# EAGLE design MainSchem (EAGLE 9.5.2)
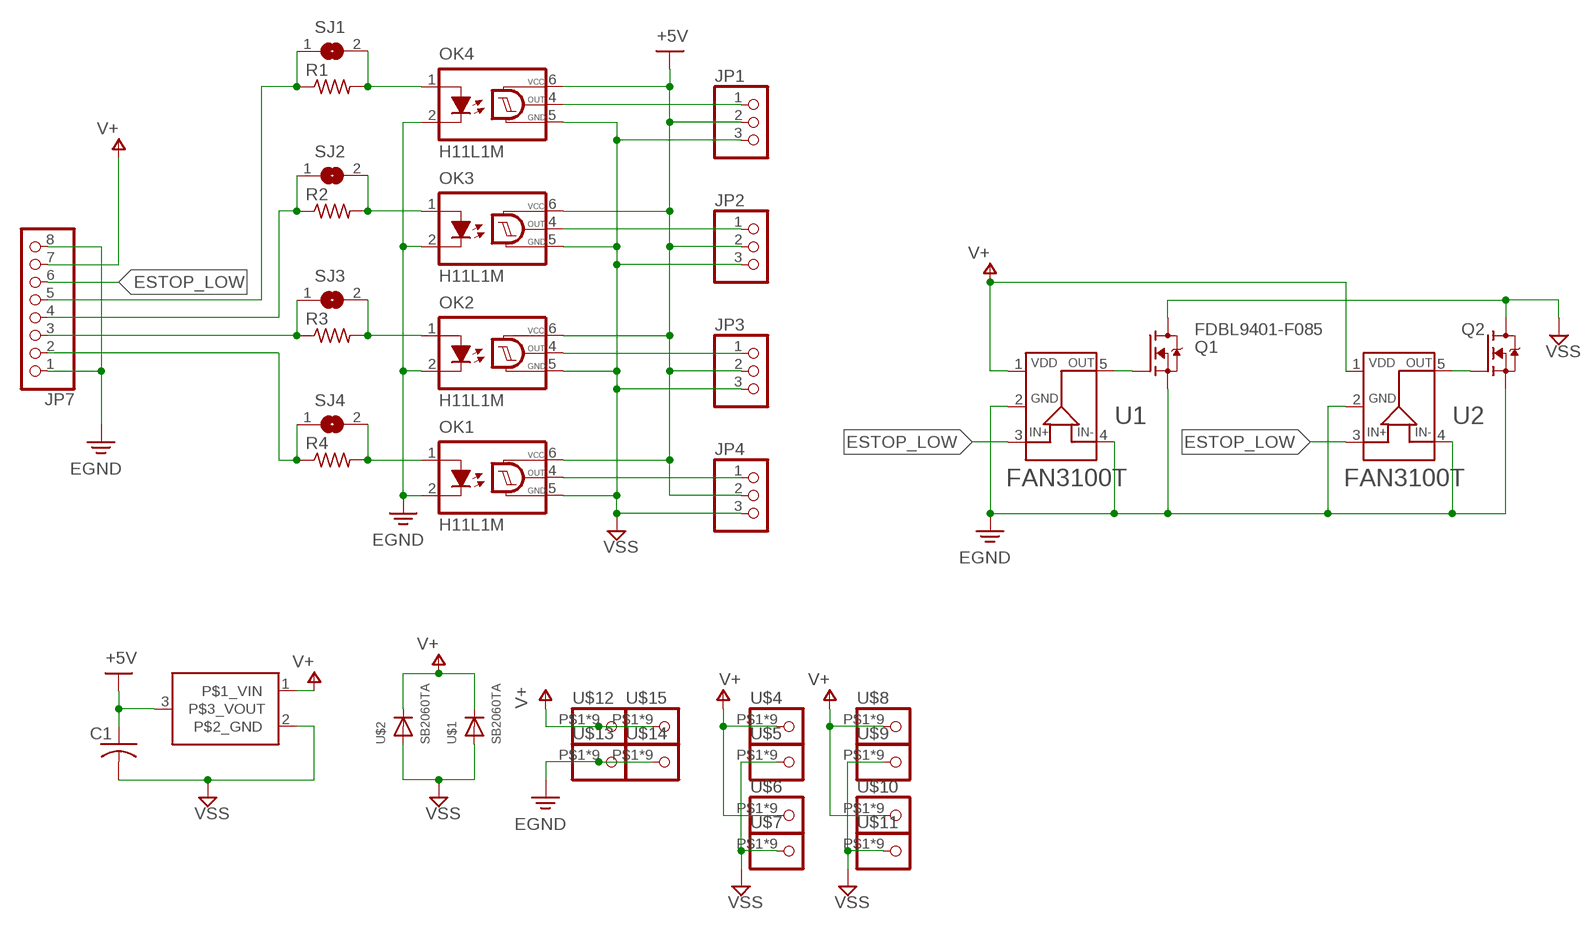
[diagram p0: schematic, sheet 1]

## Parts
C1  C-US025-025X050  [C025-025X050]
JP1  PINHD-1X3  [1X03]
JP2  PINHD-1X3  [1X03]
JP3  PINHD-1X3  [1X03]
JP4  PINHD-1X3  [1X03]
JP7  PINHD-1X8  [1X08]
OK1  H11L1M  [DIL06]
OK2  H11L1M  [DIL06]
OK3  H11L1M  [DIL06]
OK4  H11L1M  [DIL06]
Q1  FDBL9401-F085  FDBL86361-F085  [MOSFET_FDBL86361-F085]
Q2  FDBL9401-F085  FDBL86361-F085  [MOSFET_FDBL86361-F085]
R1  R-US_0204/7  [0204/7]
R2  R-US_0204/7  [0204/7]
R3  R-US_0204/7  [0204/7]
R4  R-US_0204/7  [0204/7]
SJ1  SJ  [SJ]
SJ2  SJ  [SJ]
SJ3  SJ  [SJ]
SJ4  SJ  [SJ]
U1  FAN3100T  [SOT23-5]
U2  FAN3100T  [SOT23-5]
U$1  SB2060TA  GENERIC_DIODE_DO201AD  [C4111-15]
U$2  SB2060TA  GENERIC_DIODE_DO201AD  [C4111-15]
U$3  REGULATOR_5V  [TO220]
U$4  HIGH_CURRENT_WIRE_PAD  [HIGH_CURRENT_WIRE_PAD]
U$5  HIGH_CURRENT_WIRE_PAD  [HIGH_CURRENT_WIRE_PAD]
U$6  HIGH_CURRENT_WIRE_PAD  [HIGH_CURRENT_WIRE_PAD]
U$7  HIGH_CURRENT_WIRE_PAD  [HIGH_CURRENT_WIRE_PAD]
U$8  HIGH_CURRENT_WIRE_PAD  [HIGH_CURRENT_WIRE_PAD]
U$9  HIGH_CURRENT_WIRE_PAD  [HIGH_CURRENT_WIRE_PAD]
U$10  HIGH_CURRENT_WIRE_PAD  [HIGH_CURRENT_WIRE_PAD]
U$11  HIGH_CURRENT_WIRE_PAD  [HIGH_CURRENT_WIRE_PAD]
U$12  HIGH_CURRENT_WIRE_PAD  [HIGH_CURRENT_WIRE_PAD]
U$13  HIGH_CURRENT_WIRE_PAD  [HIGH_CURRENT_WIRE_PAD]
U$14  HIGH_CURRENT_WIRE_PAD  [HIGH_CURRENT_WIRE_PAD]
U$15  HIGH_CURRENT_WIRE_PAD  [HIGH_CURRENT_WIRE_PAD]

## Nets
+5V: C1.1 JP1.2 JP2.2 JP3.2 JP4.2 OK1.6(VCC) OK2.6(VCC) OK3.6(VCC) OK4.6(VCC) U$3.3(P$3_VOUT)
EGND: JP7.1 JP7.8 OK1.2(C) OK2.2(C) OK3.2(C) OK4.2(C) Q1.2(S) Q1.3(S) Q1.4(S) Q1.5(S) Q1.6(S) Q1.7(S) Q1.8(S) Q2.2(S) Q2.3(S) Q2.4(S) Q2.5(S) Q2.6(S) Q2.7(S) Q2.8(S) U1.2(GND) U1.4(IN-) U2.2(GND) U2.4(IN-) U$13.P$1 U$13.P$2 U$13.P$3 U$13.P$4 U$13.P$5 U$13.P$6 U$13.P$7 U$13.P$8 U$13.P$9 U$14.P$1 U$14.P$2 U$14.P$3 U$14.P$4 U$14.P$5 U$14.P$6 U$14.P$7 U$14.P$8 U$14.P$9
ESTOP_LOW: JP7.6 U1.3(IN+) U2.3(IN+)
N$4: Q2.1(G) U2.5(OUT)
N$5: OK1.1(A) R4.2 SJ4.2
N$6: Q1.1(G) U1.5(OUT)
N$9: JP4.1 OK1.4(OUT)
N$10: JP7.2 R4.1 SJ4.1
N$11: JP3.1 OK2.4(OUT)
N$12: JP2.1 OK3.4(OUT)
N$13: JP1.1 OK4.4(OUT)
N$15: JP7.3 R3.1 SJ3.1
N$16: OK2.1(A) R3.2 SJ3.2
N$17: OK3.1(A) R2.2 SJ2.2
N$18: JP7.4 R2.1 SJ2.1
N$19: OK4.1(A) R1.2 SJ1.2
N$20: JP7.5 R1.1 SJ1.1
V+: JP7.7 U1.1(VDD) U2.1(VDD) U$1.C U$2.C U$3.1(P$1_VIN) U$4.P$1 U$4.P$2 U$4.P$3 U$4.P$4 U$4.P$5 U$4.P$6 U$4.P$7 U$4.P$8 U$4.P$9 U$6.P$1 U$6.P$2 U$6.P$3 U$6.P$4 U$6.P$5 U$6.P$6 U$6.P$7 U$6.P$8 U$6.P$9 U$8.P$1 U$8.P$2 U$8.P$3 U$8.P$4 U$8.P$5 U$8.P$6 U$8.P$7 U$8.P$8 U$8.P$9 U$10.P$1 U$10.P$2 U$10.P$3 U$10.P$4 U$10.P$5 U$10.P$6 U$10.P$7 U$10.P$8 U$10.P$9 U$12.P$1 U$12.P$2 U$12.P$3 U$12.P$4 U$12.P$5 U$12.P$6 U$12.P$7 U$12.P$8 U$12.P$9 U$15.P$1 U$15.P$2 U$15.P$3 U$15.P$4 U$15.P$5 U$15.P$6 U$15.P$7 U$15.P$8 U$15.P$9
VSS: C1.2 JP1.3 JP2.3 JP3.3 JP4.3 OK1.5(GND) OK2.5(GND) OK3.5(GND) OK4.5(GND) Q1.9_1(D) Q1.9_2(D) Q1.9_3(D) Q1.9_4(D) Q2.9_1(D) Q2.9_2(D) Q2.9_3(D) Q2.9_4(D) U$1.A U$2.A U$3.2(P$2_GND) U$5.P$1 U$5.P$2 U$5.P$3 U$5.P$4 U$5.P$5 U$5.P$6 U$5.P$7 U$5.P$8 U$5.P$9 U$7.P$1 U$7.P$2 U$7.P$3 U$7.P$4 U$7.P$5 U$7.P$6 U$7.P$7 U$7.P$8 U$7.P$9 U$9.P$1 U$9.P$2 U$9.P$3 U$9.P$4 U$9.P$5 U$9.P$6 U$9.P$7 U$9.P$8 U$9.P$9 U$11.P$1 U$11.P$2 U$11.P$3 U$11.P$4 U$11.P$5 U$11.P$6 U$11.P$7 U$11.P$8 U$11.P$9

## Library data of the parts
C1 = adafruit:C-US: CAPACITOR, American symbol
JP1-JP4 = adafruit:PINHD-1X3: PIN HEADER
JP7 = pinhead:PINHD-1X8: PIN HEADER
OK1-OK4 = optocoupler:H11L*M: 6-Pin DIP Optocoupler Source: http://www.fairchildsemi.com/ds/H1/H11L2-M.pdf; MF: FAIRCHILD SEMICONDUCTOR; MPN: H11L1-M; OC_FARNELL: 1021127; OC_NEWARK: 72K8643
Q1 Q2 = FDBL86361-F085:FDBL86361-F085: MOSFET N-CH 80V 300A PSOF8; DESCRIPTION: N-Channel 80V 300A _Tc_ 429W _Tj_ Surface Mount 8-HPSOF; DIGI-KEY_PART_NUMBER: FDBL86361-F085CT-ND; DIGI-KEY_PURCHASE_URL: https://www.digikey.com/product-detail/en/on-semiconductor/FDBL86361-F085/FDBL86361-F085CT-ND/5209202?utm_source=snapeda&utm_medium=aggregator&utm_campaign=symbol; MF: ON Semiconductor; MP: FDBL86361-F085; PACKAGE: PowerSFN-8 ON Semiconductor
R1-R4 = adafruit:R-US_: RESISTOR, American symbol
SJ1-SJ4 = jumper:SJ: SMD solder JUMPER
U1 U2 = HighCurrentTransistorAndDriver:FAN3100T: FAN3100T
U$1 U$2 = HighCurrentTransistorAndDriver:GENERIC_DIODE_DO201AD
U$3 = HighCurrentTransistorAndDriver:REGULATOR_5V
U$4-U$15 = HighCurrentTransistorAndDriver:HIGH_CURRENT_WIRE_PAD

## Board
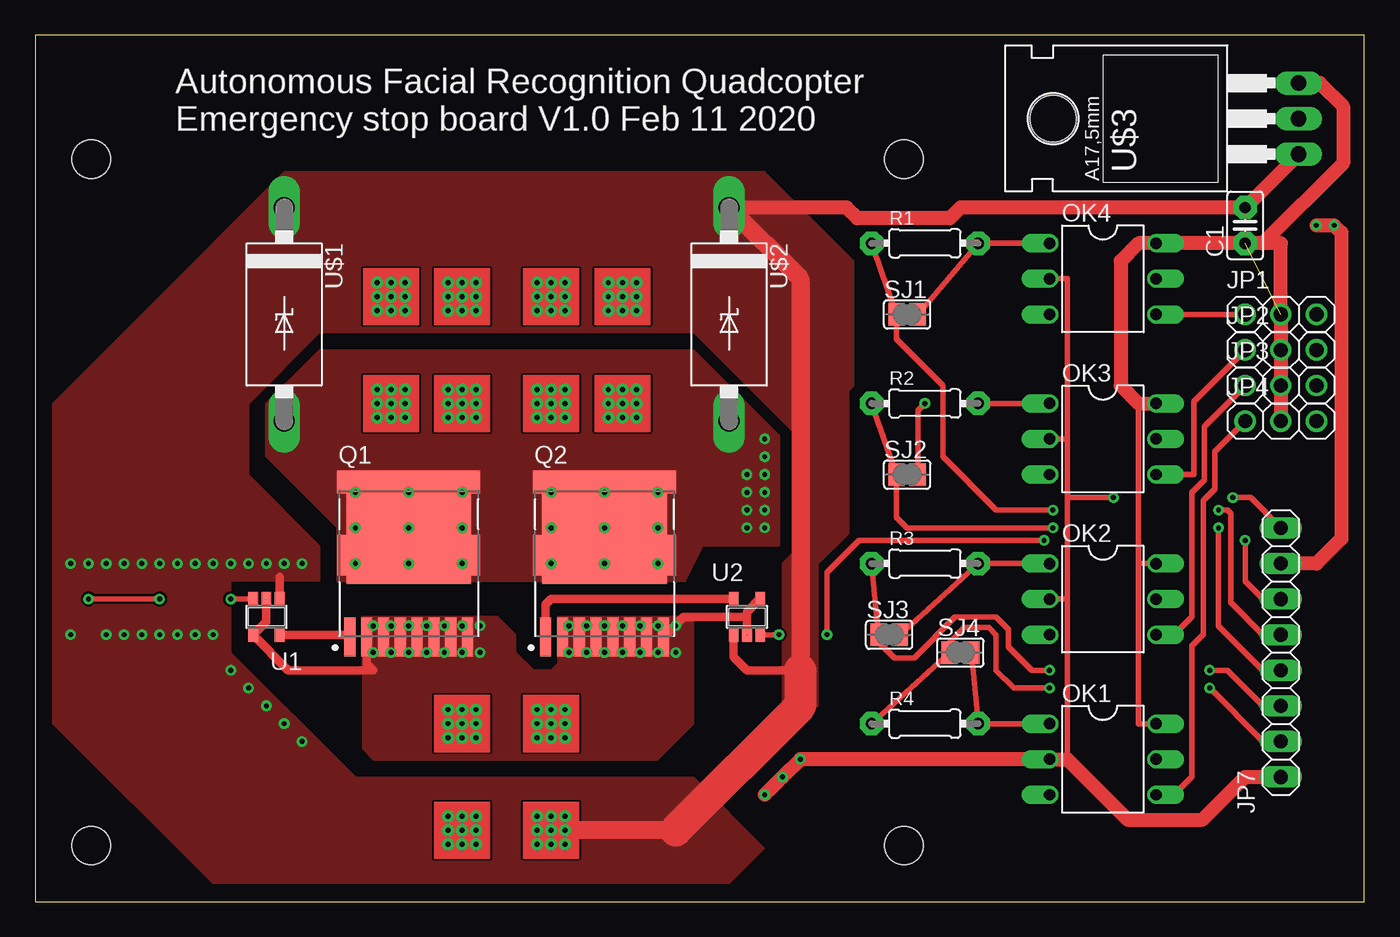
[diagram p1: board, top side]
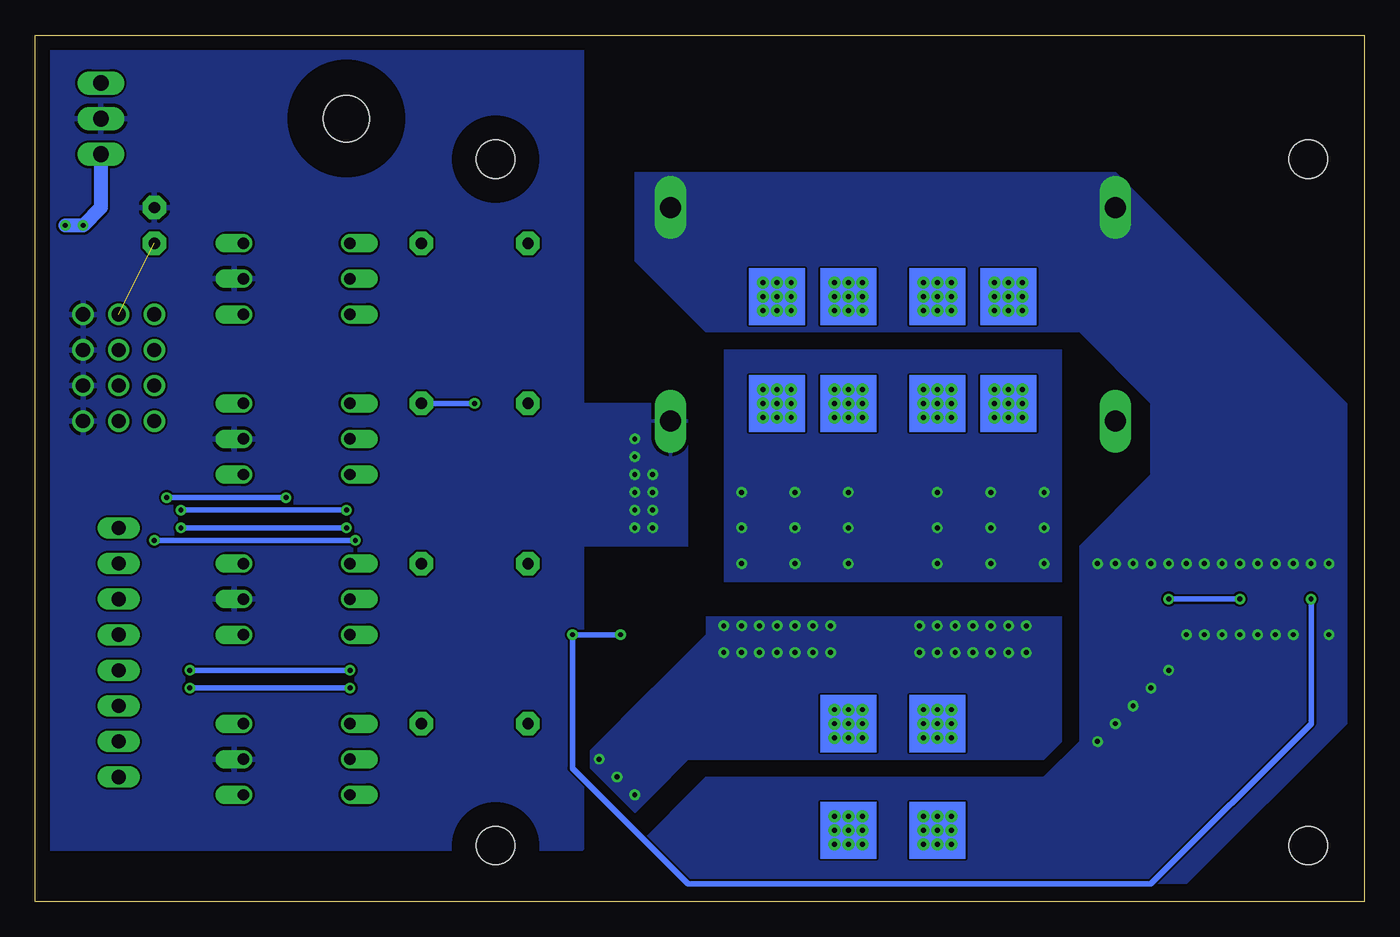
[diagram p2: board, bottom side, seen from below]

Size 94.87 x 61.85 mm. Coordinates in mm from the lower left corner, seen from the top.
Outline: 0,0 94.87,0 94.87,61.85 0,61.85 0,0
Copper layers (1*16): Top 0.035mm / dielectric 1.5mm / Bottom 0.035mm
Design rules "default": minimum track width 6mil, minimum drill 0.35mm, track to track 6mil, track to pad 6mil, pad to pad 6mil, via to via 6mil, smd to smd 6mil, copper to edge 40mil, drill to drill 6mil, minimum pad ring 10mil, minimum via ring 8mil, stop-mask expansion 4mil, vias tented up to drill 0mil, thermal gap 10mil

### Footprints (pad centres in the part's own frame; a part is rotated, then mirrored left to right if it is on the bottom)
C025-025X050 = drill 0.813 pad 1.676 octagon: 1 -1.27,0; 2 1.27,0
1X03 = drill 1.016: 1 -2.54,0; 2 0,0; 3 2.54,0
1X08 = drill 1.016 long: 1 -8.89,0; 2 -6.35,0; 3 -3.81,0; 4 -1.27,0; 5 1.27,0; 6 3.81,0; 7 6.35,0; 8 8.89,0
DIL06 = drill 0.813 offset: 1 -2.54,-3.81; 2 0,-3.81; 3 2.54,-3.81; 4 2.54,3.81; 5 0,3.81; 6 -2.54,3.81
MOSFET_FDBL86361-F085 = smd 0.8 x 2.8: 1 -4.2,-5.24; 2 -3,-5.24; 3 -1.8,-5.24; 4 -0.6,-5.24; 5 0.6,-5.24; 6 1.8,-5.24; 7 3,-5.24; 8 4.2,-5.24 | smd 10.2 x 1.65: 9_1 0,5.815 | smd 8.9 x 2.95: 9_2 0,3.515 | smd 10.2 x 2.9: 9_3 0,0.59 | smd 8.9 x 0.6: 9_4 0,-1.16
0204/7 = drill 0.813 pad 1.676 octagon: 1 -3.81,0; 2 3.81,0
SJ = smd 1.168 x 1.6: 1 -0.762,0; 2 0.762,0
SOT23-5 = smd 0.69 x 0.99: 1 -0.95,-1.29; 2 0,-1.29; 3 0.95,-1.29; 4 0.95,1.3; 5 -0.95,1.3
C4111-15 = drill 1.499 long: A 7.62,0; C -7.62,0
TO220 = drill 1.118 long: 1 -2.54,-6.35; 2 0,-6.35; 3 2.54,-6.35 | hole 3.302: 0,11.176
HIGH_CURRENT_WIRE_PAD = drill 0.35: P$1 -1,1; P$2 0,1; P$3 1,1; P$4 -1,0; P$5 0,0; P$6 1,0; P$7 -1,-1; P$8 0,-1; P$9 1,-1
RPI_MOUNTING_HOLE = hole 2.75: 0,0

### Placement (x,y rotation side)
C1  86.36,48.26 90 top
JP1  88.9,41.91 0 top
JP2  88.9,39.37 0 top
JP3  88.9,36.83 0 top
JP4  88.9,34.29 0 top
JP7  88.9,17.78 90 top
OK1  76.2,10.16 270 top
OK2  76.2,21.59 270 top
OK3  76.2,33.02 270 top
OK4  76.2,44.45 270 top
Q1  26.67,24.13 0 top
Q2  40.64,24.13 0 top
R1  63.5,46.99 0 top
R2  63.5,35.56 0 top
R3  63.5,24.13 0 top
R4  63.5,12.7 0 top
SJ1  62.23,41.91 0 top
SJ2  62.23,30.48 0 top
SJ3  60.96,19.05 0 top
SJ4  66.04,17.78 0 top
U1  16.51,20.32 180 top
U2  50.8,20.32 0 top
U$1  17.78,41.91 270 top
U$2  49.53,41.91 270 top
U$3  83.82,55.88 90 top
U$4  41.91,43.18 0 top
U$5  36.83,35.56 0 top
U$6  30.48,43.18 0 top
U$7  25.4,35.56 270 bottom
U$8  25.4,43.18 270 bottom
U$9  30.48,35.56 270 bottom
U$10  36.83,43.18 270 bottom
U$11  41.91,35.56 270 bottom
U$12  30.48,5.08 270 bottom
U$13  30.48,12.7 270 bottom
U$14  36.83,12.7 0 top
U$15  36.83,5.08 0 top
U$16  [RPI_MOUNTING_HOLE]  4,4 0 top
U$17  [RPI_MOUNTING_HOLE]  4,53 0 top
U$18  [RPI_MOUNTING_HOLE]  62,53 0 top
U$19  [RPI_MOUNTING_HOLE]  62,4 0 top

### Tracks (layer width: path | path; a pad name or v marks a point on that pad's centre or on a via)
+5V  (1 unrouted)
  Top 0.406: OK2.6 78.74,24.13 | 78.74,24.13 78.74,35.56 | 78.74,24.13 78.74,12.7 OK1.6
  Top 1.016: 87.63,46.99 88.9,46.99 JP1.2 JP2.2 JP3.2 JP4.2 | 87.63,46.99 OK4.6 78.74,46.99 77.47,45.72 77.47,36.83 78.74,35.56 OK3.6 | 87.63,46.99 93.34,52.7 93.34,56.77 91.69,58.42 U$3.3
EGND  (via drill 0.35)
  Top 0.406: 73.66,33.02 73.66,44.45 OK4.2 | 73.66,33.02 73.66,28.83 | 73.66,28.83 73.66,21.59 | 73.66,21.59 73.66,10.16 | OK2.2 73.66,21.59 | OK3.2 73.66,33.02 | JP7.8 86.74,28.83 v85.47,28.83 | v76.96,28.83 73.66,28.83
  Top 0.61: U1.2 16.51,19.97 U1.4 18.07,16.51 24.13,16.51 23.67,16.97 Q1.2 | U2.2 50.8,20.32 | 50.8,20.32 50.8,20.67 U2.4 | Q2.8 46.27,20.32 50.8,20.32
  Top 1.016: JP7.1 86.36,8.89 83.31,5.84 77.98,5.84 73.66,10.16 OK1.2 v54.61,10.16 v53.34,8.89 v52.07,7.62
  Bottom 0.406: v85.47,28.83 v76.96,28.83
  other vias: 24.13,19.68 25.4,19.68 26.67,19.68 27.94,19.68 29.21,19.68 30.48,19.68 31.75,19.68 24.13,17.78 25.4,17.78 26.67,17.78 27.94,17.78 29.21,17.78 30.48,17.78 31.75,17.78 38.1,17.78 39.37,17.78 40.64,17.78 41.91,17.78 43.18,17.78 44.45,17.78 45.72,17.78 38.1,19.68 39.37,19.68 40.64,19.68 41.91,19.68 43.18,19.68 44.45,19.68 45.72,19.68
  pour Top (no thermals): 46.99,20.32 37.34,20.32 37.34,17.02 36.83,16.51 35.56,16.51 34.29,17.78 34.29,19.05 33.02,20.32 23.37,20.32 23.37,10.92 24.13,10.16 44.45,10.16 46.99,12.7
  pour Bottom: 46.99,11.43 52.07,6.35 55.24,9.53 55.24,10.79 50.8,15.24
  pour Bottom (no thermals): 21.59,11.43 21.59,20.32 46.99,20.32 46.99,19.05 52.07,13.97 48.26,10.16 22.86,10.16
ESTOP_LOW  (via drill 0.35)
  Top 0.406: JP7.6 87.63,21.59 86.36,22.86 v86.36,25.78 | U2.3 53.07,19.03 v53.09,19.05 | v56.52,19.05 56.52,23.5 58.8,25.78 v72.01,25.78 | U1.3 15.54,21.59 v13.97,21.59 | v8.89,21.59 v3.81,21.59
  Bottom 0.406: v86.36,25.78 v72.01,25.78 | v53.09,19.05 v56.52,19.05 56.52,9.53 48.26,1.27 15.24,1.27 3.81,12.7 v3.81,21.59 | v13.97,21.59 v8.89,21.59
N$4
  Top 0.61: Q2.1 36.44,21.2 36.83,21.59 49.82,21.59 U2.5
N$5
  Top 0.406: OK1.1 R4.2 SJ4.2
N$6
  Top 0.61: U1.5 22.34,19.02 Q1.1
N$9
  Top 0.406: JP4.1 84.2,32.13 84.2,29.46 83.36,28.63 83.36,19.07 82.55,18.26 82.55,8.89 81.28,7.62 OK1.4
N$10  (via drill 0.35)
  Top 0.406: v83.82,15.24 87.63,11.43 JP7.2 | R4.1 SJ4.1 65.28,18.54 66.29,19.56 68.07,19.56 68.58,19.05 68.58,16.51 69.85,15.24 v72.39,15.24
  Bottom 0.406: v72.39,15.24 v83.82,15.24
N$11
  Top 0.406: JP3.1 83.44,33.91 83.44,30.1 82.55,29.21 82.55,20.32 81.28,19.05 OK2.4
N$12
  Top 0.406: OK3.4 82.68,30.48 82.68,35.69 JP2.1
N$13
  Top 0.406: OK4.4 JP1.1
N$15  (via drill 0.35)
  Top 0.406: v83.82,16.51 85.09,16.51 87.63,13.97 JP7.3 | R3.1 SJ3.1 60.2,18.54 61.34,17.4 62.74,17.4 65.66,20.32 68.58,20.32 69.47,19.43 69.47,18.16 71.12,16.51 v72.39,16.51
  Bottom 0.406: v72.39,16.51 v83.82,16.51
N$16
  Top 0.406: OK2.1 R3.2 SJ3.2
N$17  (via drill 0.35)
  Top 0.406: OK3.1 R2.2 | SJ2.2 62.99,35.05 v63.5,35.56
  Bottom 0.406: v63.5,35.56 R2.2
N$18  (via drill 0.35)
  Top 0.406: R2.1 SJ2.1 61.47,27.43 62.23,26.67 v72.64,26.67 | JP7.4 87.63,16.51 84.45,19.68 v84.45,26.67
  Bottom 0.406: v72.64,26.67 v84.45,26.67
N$19
  Top 0.406: OK4.1 R1.2 SJ1.2
N$20  (via drill 0.35)
  Top 0.406: R1.1 SJ1.1 61.47,40.13 64.77,36.83 64.77,31.75 68.58,27.94 v72.64,27.94 | v84.45,27.94 85.09,27.94 85.34,27.69 85.34,21.34 87.63,19.05 JP7.5
  Bottom 0.406: v72.64,27.94 v84.45,27.94
V+  (via drill 0.35)
  Top 0.61: U1.1 17.46,23.18 | U2.1 49.85,17.46 50.8,16.51 54.61,16.51
  Top 1.016: JP7.7 91.44,24.13 93.22,25.91 93.22,47.75 v92.71,48.26 v91.44,48.26 | U$3.1 86.36,49.53 66.04,49.53 65.28,48.77 58.67,48.77 57.91,49.53 U$2.C
  Top 1.27: U$2.C 54.61,44.45 54.61,16.51 | 45.72,5.08 U$15.P$5
  Top 2.286: 54.61,16.51 54.61,13.97 45.72,5.08
  Bottom 1.016: U$3.1 90.17,49.53 v91.44,48.26 v92.71,48.26
  other vias: 5.08,19.05 6.35,19.05 7.62,19.05 8.89,19.05 10.16,19.05 11.43,19.05 12.7,19.05 13.97,16.51 15.24,15.24 16.51,13.97 17.78,12.7 19.05,11.43 2.54,19.05 2.54,24.13 3.81,24.13 5.08,24.13 6.35,24.13 7.62,24.13 8.89,24.13 10.16,24.13 11.43,24.13 12.7,24.13 13.97,24.13 15.24,24.13 16.51,24.13 17.78,24.13 19.05,24.13
  pour Top (no thermals): 15.24,35.56 20.32,40.64 46.99,40.64 54.61,33.02 54.61,25.4 53.34,24.13 53.34,13.97 55.88,13.97 55.88,24.13 58.04,26.29 58.04,36.45 58.42,36.83 58.42,45.72 52.07,52.07 17.78,52.07 12.7,46.99 12.7,35.56
  pour Top: 46.99,8.89 52.07,3.81 49.53,1.27 12.7,1.27 1.27,12.7 1.27,35.56 13.97,48.26 13.97,36.83 15.24,35.56 15.24,30.48 20.32,25.4 20.32,22.86 13.97,22.86 13.97,17.78 22.86,8.89
  pour Bottom (no thermals): 46.99,40.64 52.07,45.72 52.07,52.07 17.78,52.07 1.27,35.56 1.27,12.7 12.7,1.27 49.53,1.27 52.07,3.81 46.99,8.89 22.86,8.89 20.32,11.43 20.32,25.4 15.24,30.48 15.24,35.56 20.32,40.64
VSS  (via drill 0.35)
  other vias: 50.8,26.67 52.07,26.67 50.8,27.94 52.07,27.94 50.8,29.21 52.07,29.21 50.8,30.48 52.07,30.48 52.07,31.75 52.07,33.02 22.86,29.21 22.86,26.67 22.86,24.13 26.67,24.13 26.67,26.67 26.67,29.21 30.48,26.67 30.48,24.13 30.48,29.21 36.83,24.13 36.83,26.67 36.83,29.21 40.64,29.21 40.64,24.13 40.64,26.67 44.45,26.67 44.45,24.13 44.45,29.21
  pour Bottom: 55.88,60.96 55.88,3.81 93.98,3.81 93.98,60.96
  pour Top (no thermals): 20.32,39.37 46.99,39.37 53.09,33.27 53.09,25.4 47.62,25.4 46.35,22.86 21.59,22.86 21.59,26.67 16.51,31.75 16.51,35.56
  pour Bottom: 48.26,25.4 48.26,35.56 57.15,35.56 57.15,25.4
  pour Bottom: 21.59,22.86 21.59,39.37 45.72,39.37 45.72,22.86

### Text on the board
tNames: Autonomous Facial Recognition Quadcopter / Emergency stop board V1.0 Feb 11 2020